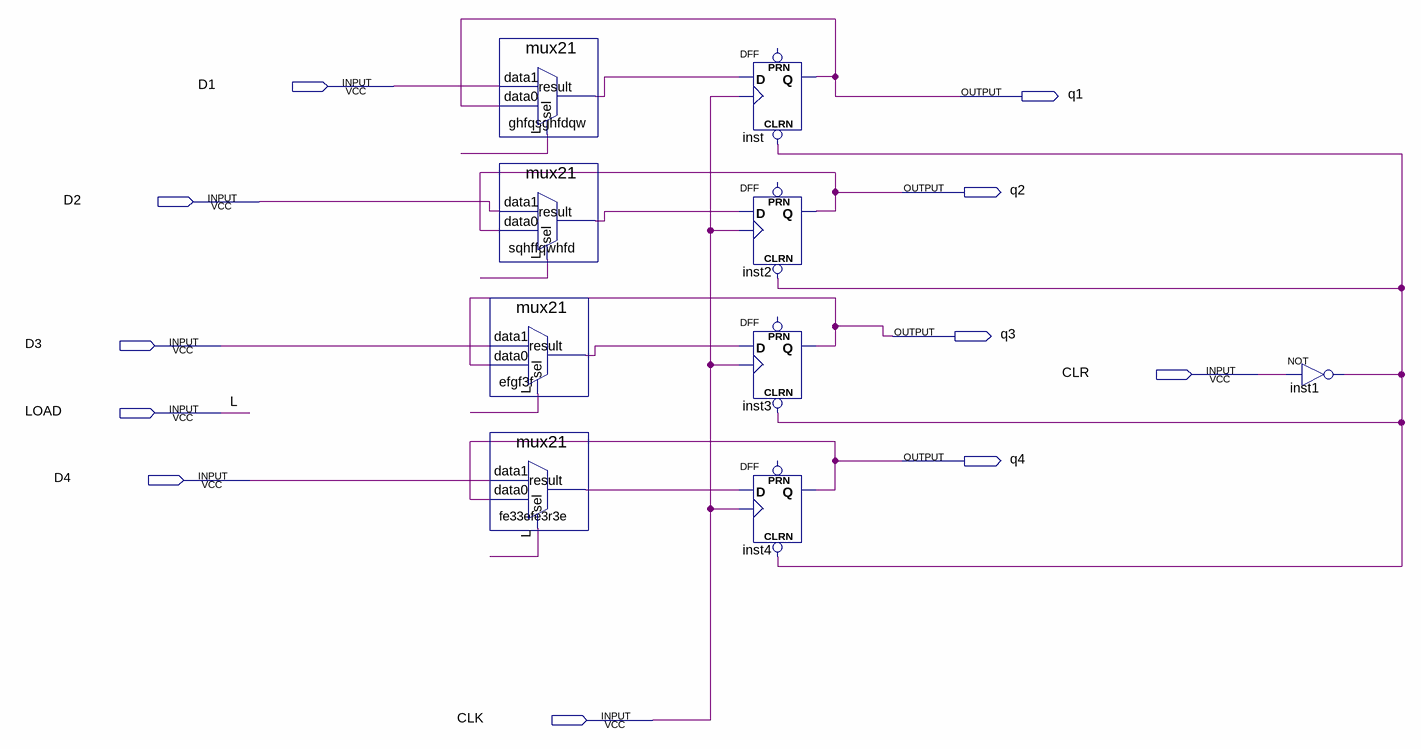
[diagram p0: schematic sheet]
// Quartus schematic flipflop.bdf as structural Verilog: 9 symbols, 11 pins
module flipflop (
  input  D1,
  input  D2,
  input  D3,
  input  CLR,
  input  LOAD,
  input  D4,
  input  CLK,
  output q1,
  output q2,
  output q3,
  output q4
);

  wire efgf3f_result, fe33efe3r3e_result, ghfqsghfdqw_result, inst1_out, sqhffqwhfd_result;

  mux21 ghfqsghfdqw (.data1(D1), .data0(q1), .sel(LOAD), .result(ghfqsghfdqw_result));
  mux21 sqhffqwhfd (.data1(D2), .data0(q2), .sel(LOAD), .result(sqhffqwhfd_result));
  mux21 efgf3f (.data1(D3), .data0(q3), .sel(LOAD), .result(efgf3f_result));
  mux21 fe33efe3r3e (.data1(D4), .data0(q4), .sel(LOAD), .result(fe33efe3r3e_result));
  DFF inst (.CLRN(inst1_out), .CLK(CLK), .D(ghfqsghfdqw_result), .Q(q1));  // open: PRN
  DFF inst2 (.CLRN(inst1_out), .CLK(CLK), .D(sqhffqwhfd_result), .Q(q2));  // open: PRN
  DFF inst3 (.CLRN(inst1_out), .CLK(CLK), .D(efgf3f_result), .Q(q3));  // open: PRN
  DFF inst4 (.CLRN(inst1_out), .CLK(CLK), .D(fe33efe3r3e_result), .Q(q4));  // open: PRN
  not inst1 (inst1_out, CLR);

  // Other names for the same wires on the sheet: L = LOAD
endmodule
